# Altium schematic sheet PROC_partA_(SRAM,NAND,LCD).SchDoc
size A3
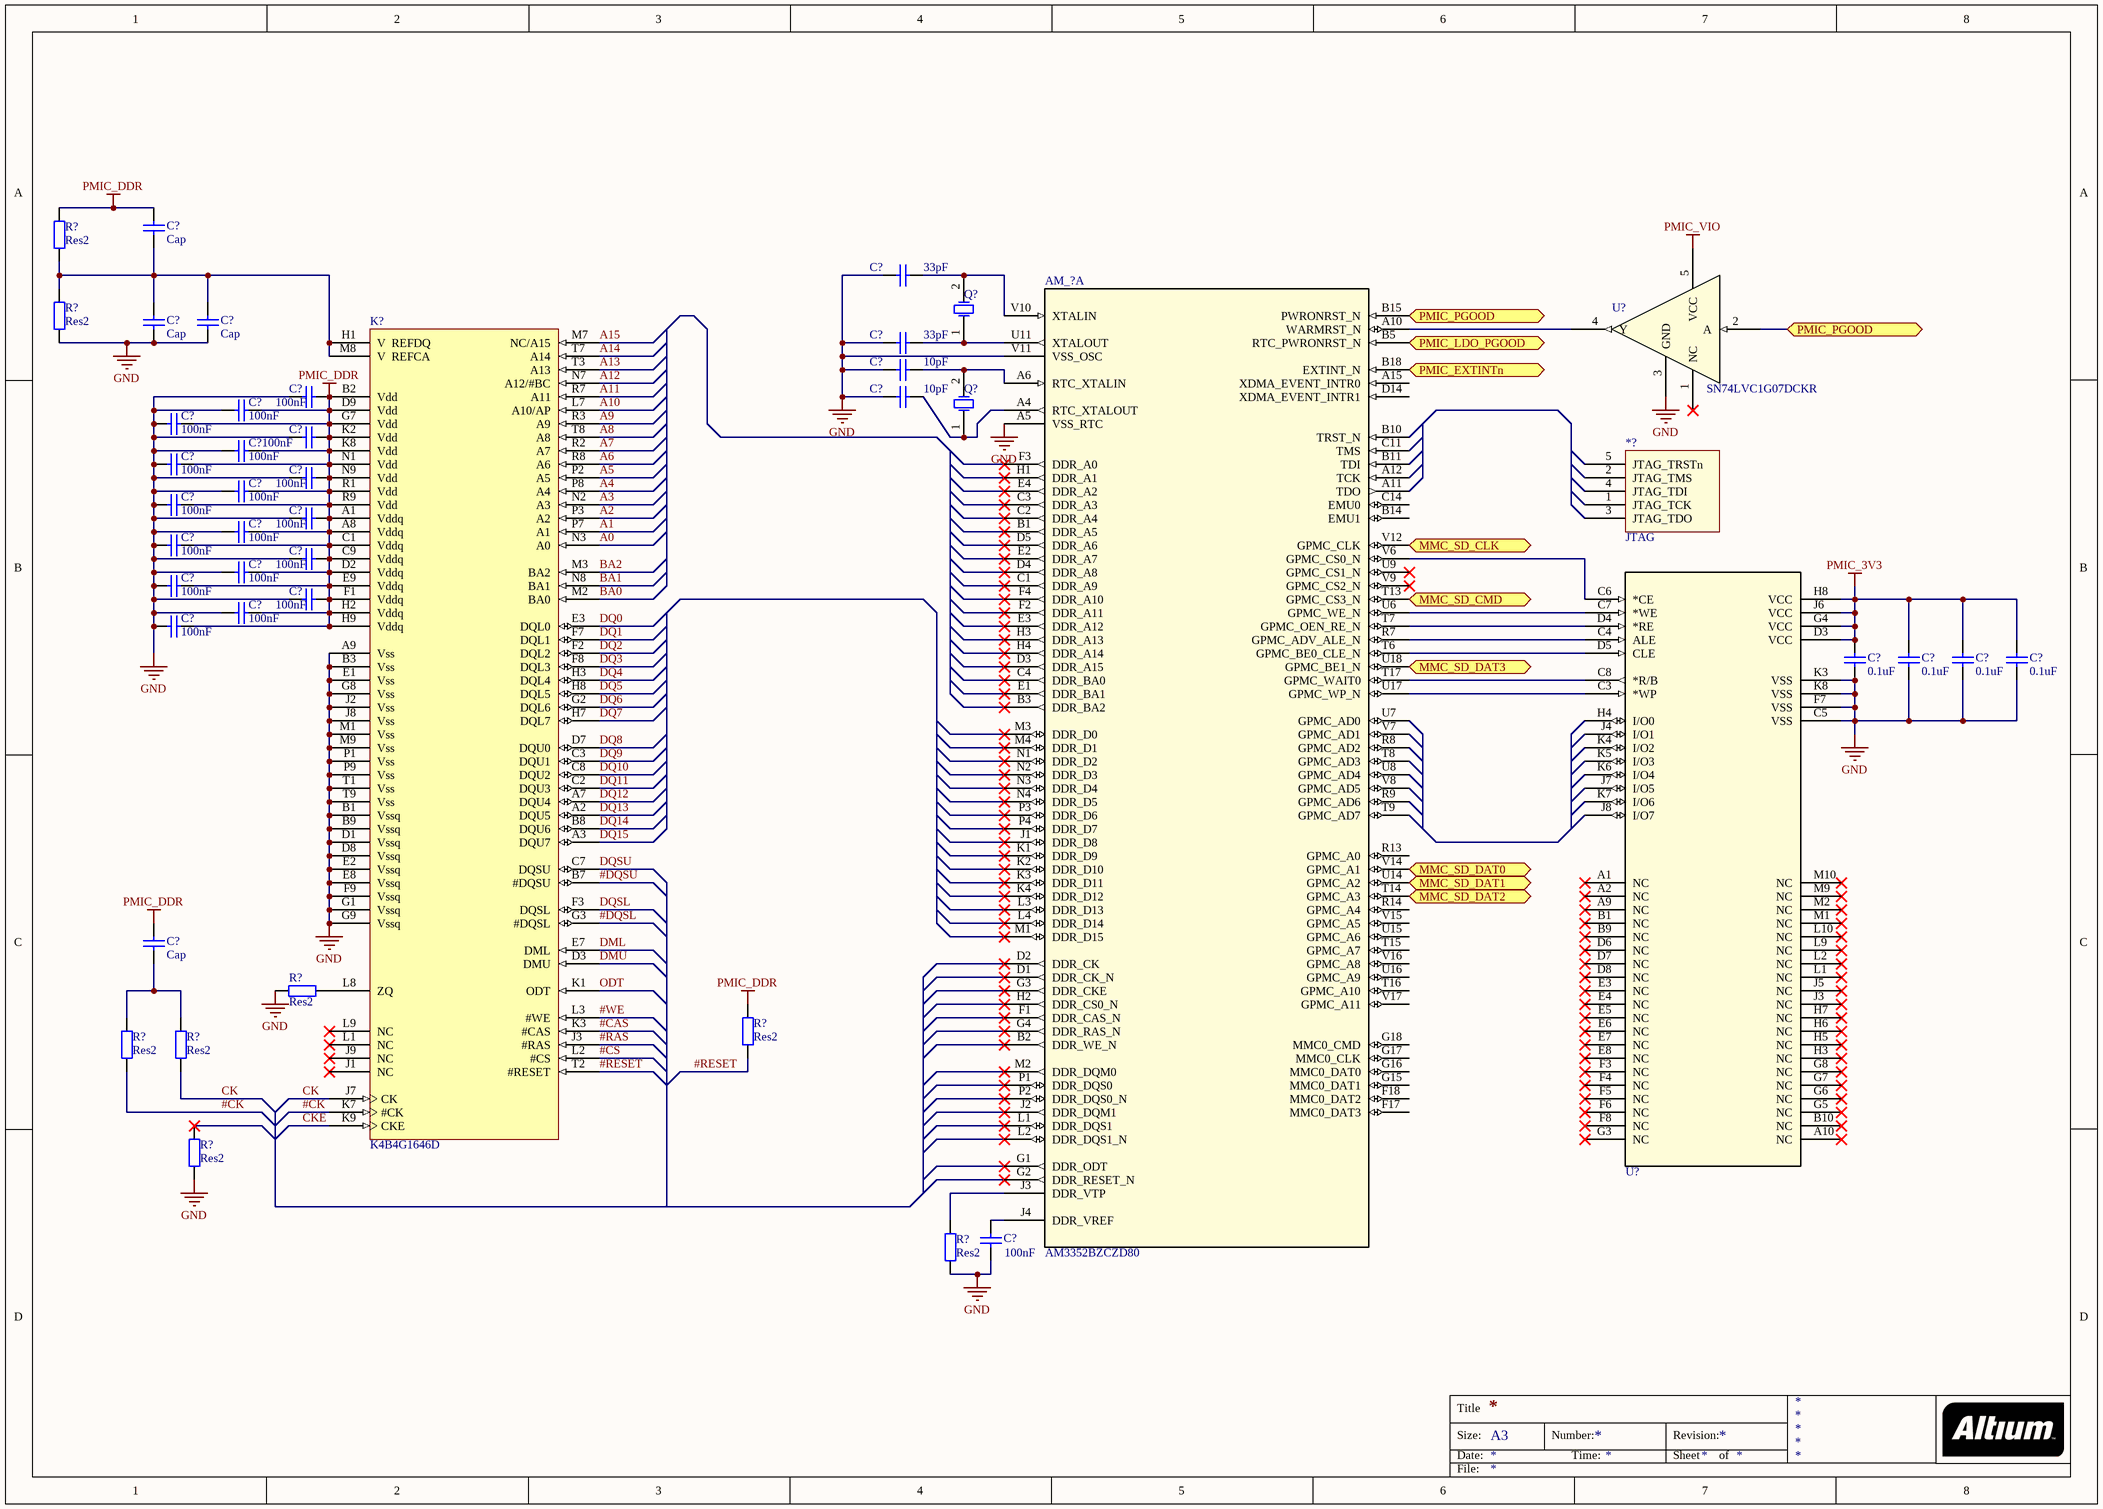
[diagram p0: PROC_partA_(SRAM,NAND,LCD).SchDoc]

## Parts
(Parts that share a designator on the sheet are numbered #1, #2 ... from top to bottom, then left to right.)
*?  JTAG
AM_?  AM3352BZCZD80  [BGA324C80P18X18_800X1508X1508]  (part A of 4)
C?#1  Cap  [RAD-0.3]
C?#2  value 33pF  [RAD-0.3]  (hidden comment: Cap)
C?#3  Cap  [RAD-0.3]
C?#4  Cap  [RAD-0.3]
C?#5  value 33pF  [RAD-0.3]  (hidden comment: Cap)
C?#6  value 10pF  [RAD-0.3]  (hidden comment: Cap)
C?#7  value 10pF  [RAD-0.3]  (hidden comment: Cap)
C?#8  100nF  [0402]
C?#9  100nF  [0402]
C?#10  100nF  [0402]
C?#11  100nF  [0402]
C?#12  100nF  [0402]
C?#13  100nF  [0402]
C?#14  100nF  [0402]
C?#15  100nF  [0402]
C?#16  100nF  [0402]
C?#17  100nF  [0402]
C?#18  100nF  [0402]
C?#19  100nF  [0402]
C?#20  100nF  [0402]
C?#21  100nF  [0402]
C?#22  100nF  [0402]
C?#23  100nF  [0402]
C?#24  100nF  [0402]
C?#25  100nF  [0402]
C?#26  value 0.1uF  [1608[0603]]  (hidden comment: Cap Semi)
C?#27  value 0.1uF  [1608[0603]]  (hidden comment: Cap Semi)
C?#28  value 0.1uF  [1608[0603]]  (hidden comment: Cap Semi)
C?#29  value 0.1uF  [1608[0603]]  (hidden comment: Cap Semi)
C?#30  Cap  [RAD-0.3]
C?#31  value 100nF  [RAD-0.3]  (hidden comment: Cap)
K?  K4B4G1646D
Q?#1  XTAL  [R38]  (value not drawn)
Q?#2  XTAL  [R38]  (value not drawn)
R?#1  Res2  [AXIAL-0.4]
R?#2  Res2  [AXIAL-0.4]
R?#3  Res2  [AXIAL-0.4]
R?#4  Res2  [AXIAL-0.4]
R?#5  Res2  [AXIAL-0.4]
R?#6  Res2  [AXIAL-0.4]
R?#7  Res2  [AXIAL-0.4]
R?#8  Res2  [AXIAL-0.4]
U?#1  SN74LVC1G07DCKR  [DCK5]
U?#2  S34ML01G200BHI000  [BGA63C80P12X10_100X1100X900]  (value not drawn)

## Ports
MMC_SD_CLK, MMC_SD_CMD, MMC_SD_DAT0, MMC_SD_DAT1, MMC_SD_DAT2, MMC_SD_DAT3, PMIC_EXTINTn, PMIC_LDO_PGOOD, PMIC_PGOOD

## Nets
GND: AM_?.A5(VSS_RTC) AM_?.V11(VSS_OSC) C?#2.1 C?#3.1 C?#4.1 C?#5.1 C?#6.1 C?#7.1 C?#8.2 C?#9.2 C?#10.2 C?#11.2 C?#12.2 C?#13.2 C?#14.2 C?#15.2 C?#16.2 C?#17.2 C?#18.2 C?#19.2 C?#20.2 C?#21.2 C?#22.2 C?#23.2 C?#24.2 C?#25.2 C?#26.1 C?#27.1 C?#28.1 C?#29.1 C?#31.1 K?.A9(Vss) K?.B1(Vssq) K?.B3(Vss) K?.B9(Vssq) K?.D1(Vssq) K?.D8(Vssq) K?.E1(Vss) K?.E2(Vssq) K?.E8(Vssq) K?.F9(Vssq) K?.G1(Vssq) K?.G8(Vss) K?.G9(Vssq) K?.J2(Vss) K?.J8(Vss) K?.M1(Vss) K?.M9(Vss) K?.P1(Vss) K?.P9(Vss) K?.T1(Vss) K?.T9(Vss) R?#2.1 R?#3.2 R?#7.1 R?#8.1 U?#1.3(GND) U?#2.C5(VSS) U?#2.F7(VSS) U?#2.K3(VSS) U?#2.K8(VSS)
PMIC_3V3: C?#26.2 C?#27.2 C?#28.2 C?#29.2 U?#2.D3(VCC) U?#2.G4(VCC) U?#2.H8(VCC) U?#2.J6(VCC)
PMIC_DDR: C?#1.2 C?#8.1 C?#9.1 C?#10.1 C?#11.1 C?#12.1 C?#13.1 C?#14.1 C?#15.1 C?#16.1 C?#17.1 C?#18.1 C?#19.1 C?#20.1 C?#21.1 C?#22.1 C?#23.1 C?#24.1 C?#25.1 C?#30.2 K?.A1(Vddq) K?.A8(Vddq) K?.B2(Vdd) K?.C1(Vddq) K?.C9(Vddq) K?.D2(Vddq) K?.D9(Vdd) K?.E9(Vddq) K?.F1(Vddq) K?.G7(Vdd) K?.H2(Vddq) K?.H9(Vddq) K?.K2(Vdd) K?.K8(Vdd) K?.N1(Vdd) K?.N9(Vdd) K?.R1(Vdd) K?.R9(Vdd) R?#1.2 R?#4.2
PMIC_VIO: U?#1.5(VCC)
#CAS: K?.K3(#CAS)
#CK: K?.K7(#CK) R?#5.1
#CS: K?.L2(#CS)
#DQSL: K?.G3(#DQSL)
#DQSU: K?.B7(#DQSU)
#RAS: K?.J3(#RAS)
#RESET: K?.T2(#RESET) R?#4.1
#WE: K?.L3(#WE)
A0: K?.N3(A0)
A1: K?.P7(A1)
A2: K?.P3(A2)
A3: K?.N2(A3)
A4: K?.P8(A4)
A5: K?.P2(A5)
A6: K?.R8(A6)
A7: K?.R2(A7)
A8: K?.T8(A8)
A9: K?.R3(A9)
A10: K?.L7(A10/AP)
A11: K?.R7(A11)
A12: K?.N7(A12/#BC)
A13: K?.T3(A13)
A14: K?.T7(A14)
A15: K?.M7(NC/A15)
BA0: K?.M2(BA0)
BA1: K?.N8(BA1)
BA2: K?.M3(BA2)
CK: K?.J7(CK) R?#6.1
CKE: K?.K9(CKE)
DML: K?.E7(DML)
DMU: K?.D3(DMU)
DQ0: K?.E3(DQL0)
DQ1: K?.F7(DQL1)
DQ2: K?.F2(DQL2)
DQ3: K?.F8(DQL3)
DQ4: K?.H3(DQL4)
DQ5: K?.H8(DQL5)
DQ6: K?.G2(DQL6)
DQ7: K?.H7(DQL7)
DQ8: K?.D7(DQU0)
DQ9: K?.C3(DQU1)
DQ10: K?.C8(DQU2)
DQ11: K?.C2(DQU3)
DQ12: K?.A7(DQU4)
DQ13: K?.A2(DQU5)
DQ14: K?.B8(DQU6)
DQ15: K?.A3(DQU7)
DQSL: K?.F3(DQSL)
DQSU: K?.C7(DQSU)
MMC_SD_CLK: AM_?.V12(GPMC_CLK) ; port MMC_SD_CLK
MMC_SD_CMD: AM_?.T13(GPMC_CS3_N) ; port MMC_SD_CMD
MMC_SD_DAT0: AM_?.V14(GPMC_A1) ; port MMC_SD_DAT0
MMC_SD_DAT1: AM_?.U14(GPMC_A2) ; port MMC_SD_DAT1
MMC_SD_DAT2: AM_?.T14(GPMC_A3) ; port MMC_SD_DAT2
MMC_SD_DAT3: AM_?.U18(GPMC_BE1_N) ; port MMC_SD_DAT3
ODT: K?.K1(ODT)
PMIC_EXTINTn: AM_?.B18(EXTINT_N) ; port PMIC_EXTINTn
PMIC_LDO_PGOOD: AM_?.B5(RTC_PWRONRST_N) ; port PMIC_LDO_PGOOD
PMIC_PGOOD: AM_?.B15(PWRONRST_N) U?#1.2(A) ; port PMIC_PGOOD
NetAM_?_A4: AM_?.A4(RTC_XTALOUT) C?#7.2 Q?#2.1(OSC1)
NetAM_?_A6: AM_?.A6(RTC_XTALIN) C?#6.2 Q?#2.2(OSC2)
NetAM_?_A10: AM_?.A10(WARMRST_N) U?#1.4(Y)
NetAM_?_J3: AM_?.J3(DDR_VTP) R?#8.2
NetAM_?_J4: AM_?.J4(DDR_VREF) C?#31.2
NetAM_?_R7: AM_?.R7(GPMC_ADV_ALE_N) U?#2.C4(ALE)
NetAM_?_T6: AM_?.T6(GPMC_BE0_CLE_N) U?#2.D5(CLE)
NetAM_?_T7: AM_?.T7(GPMC_OEN_RE_N) U?#2.D4(*RE)
NetAM_?_T17: AM_?.T17(GPMC_WAIT0) U?#2.C8(*R/B)
NetAM_?_U6: AM_?.U6(GPMC_WE_N) U?#2.C7(*WE)
NetAM_?_U11: AM_?.U11(XTALOUT) C?#5.2 Q?#1.1(OSC1)
NetAM_?_U17: AM_?.U17(GPMC_WP_N) U?#2.C3(*WP)
NetAM_?_V6: AM_?.V6(GPMC_CS0_N) U?#2.C6(*CE)
NetAM_?_V10: AM_?.V10(XTALIN) C?#2.2 Q?#1.2(OSC2)
NetC?#1_1: C?#1.1 C?#3.2 C?#4.2 K?.H1(V__REFDQ) K?.M8(V__REFCA) R?#1.1 R?#2.2
NetC?#30_1: C?#30.1 R?#5.2 R?#6.2
NetK?_L8: K?.L8(ZQ) R?#3.1

Not connected (* = marked no-connect by the designer): *? 1(JTAG_TCK) 2(JTAG_TMS) 3(JTAG_TDO) 4(JTAG_TDI) 5(JTAG_TRSTn); AM_? A11(TDO) A12(TCK) A15(XDMA_EVENT_INTR0) B1(DDR_A5)* B2(DDR_WE_N)* B3(DDR_BA2)* B10(TRST_N) B11(TDI) B14(EMU1) C1(DDR_A9)* C2(DDR_A4)* C3(DDR_A3)* C4(DDR_BA0)* C11(TMS) C14(EMU0) D1(DDR_CK_N)* D2(DDR_CK)* D3(DDR_A15)* D4(DDR_A8)* D5(DDR_A6)* D14(XDMA_EVENT_INTR1) E1(DDR_BA1)* E2(DDR_A7)* E3(DDR_A12)* E4(DDR_A2)* F1(DDR_CAS_N)* F2(DDR_A11)* F3(DDR_A0)* F4(DDR_A10)* F17(MMC0_DAT3) F18(MMC0_DAT2) G1(DDR_ODT)* G2(DDR_RESET_N)* G3(DDR_CKE)* G4(DDR_RAS_N)* G15(MMC0_DAT1) G16(MMC0_DAT0) G17(MMC0_CLK) G18(MMC0_CMD) H1(DDR_A1)* H2(DDR_CS0_N)* H3(DDR_A13)* H4(DDR_A14)* J1(DDR_D8)* J2(DDR_DQM1)* K1(DDR_D9)* K2(DDR_D10)* K3(DDR_D11)* K4(DDR_D12)* L1(DDR_DQS1)* L2(DDR_DQS1_N)* L3(DDR_D13)* L4(DDR_D14)* M1(DDR_D15)* M2(DDR_DQM0)* M3(DDR_D0)* M4(DDR_D1)* N1(DDR_D2)* N2(DDR_D3)* N3(DDR_D4)* N4(DDR_D5)* P1(DDR_DQS0)* P2(DDR_DQS0_N)* P3(DDR_D6)* P4(DDR_D7)* R8(GPMC_AD2) R9(GPMC_AD6) R13(GPMC_A0) R14(GPMC_A4) T8(GPMC_AD3) T9(GPMC_AD7) T15(GPMC_A7) T16(GPMC_A10) U7(GPMC_AD0) U8(GPMC_AD4) U9(GPMC_CS1_N)* U15(GPMC_A6) U16(GPMC_A9) V7(GPMC_AD1) V8(GPMC_AD5) V9(GPMC_CS2_N)* V15(GPMC_A5) V16(GPMC_A8) V17(GPMC_A11); K? J1(NC)* J9(NC)* L1(NC)* L9(NC)*; R?#7 2*; U?#1 1(NC)*; U?#2 A1(NC)* A2(NC)* A9(NC)* A10(NC)* B1(NC)* B9(NC)* B10(NC)* D6(NC)* D7(NC)* D8(NC)* E3(NC)* E4(NC)* E5(NC)* E6(NC)* E7(NC)* E8(NC)* F3(NC)* F4(NC)* F5(NC)* F6(NC)* F8(NC)* G3(NC)* G5(NC)* G6(NC)* G7(NC)* G8(NC)* H3(NC)* H4(I/O0) H5(NC)* H6(NC)* H7(NC)* J3(NC)* J4(I/O1) J5(NC)* J7(I/O5) J8(I/O7) K4(I/O2) K5(I/O3) K6(I/O4) K7(I/O6) L1(NC)* L2(NC)* L9(NC)* L10(NC)* M1(NC)* M2(NC)* M9(NC)* M10(NC)*

## Notes on the sheet
- Title
- Size:
- Date:
- A3
- Number:
- Time:
- Revision:
- Sheet
- of
- File:

## Library data of the parts
*? = JTAG: Connecteurs carte à carte; Fournisseur: Farnell; RefFournisseur: 1593414; Fabricant: multicomp; RefFabricant: 2211S-05G
AM_? = AM3352BZCZD80: Microprocesseur ARM; Fabricant: Texas Instrument; Fournisseur: Farnell; RefFabricant: AM3352BZCZ100; RefFournisseur: 2494119; Value: Value
C?#1 C?#3 C?#4 C?#8-C?#25 C?#30 = Cap: Capacitor; Value: 100pF
C?#2 C?#5-C?#7 C?#31 = Cap: Capacitor
C?#26-C?#29 = Cap Semi: Capacitor (Semiconductor SIM Model)
K? = K4B4G1646D: Mémoire DDR3/SRAM; Fabricant: Samsung; Fournisseur: Olimex; RefFabricant: DS_K4B4G1646D; RefFournisseur: K4B4G1646D-BCK0
Q?#1 = XTAL: Crystal Oscillator; Fabricant: EPSON; Fournisseur: Farnell; RefFabricant: Q13MC30610006 MC-306 32.768KHZ 6.0PF; RefFournisseur: 1712823
Q?#2 = XTAL: Crystal Oscillator; Fournisseur: Farnell
R?#1-R?#8 = Res2: Resistor; Value: 1K
U?#1 = SN74LVC1G07DCKR: Imported; Fabricant: Texas Instrument; Fournisseur: Farnell; RefFournisseur: 1287544; RefFabricant: SN74LVC1G07DCKR
U?#2 = S34ML01G200BHI00: Mémoire Flash/NAND; Fabricant: Cypress Semiconductor; Fournisseur: Farnell; RefFournisseur: 2646449; RefFabricant: S34ML01G200BHI000